# Altium schematic sheet EDU_High-Speed-Design_CPU_Control.SchDoc: CPU Control
size 431 x 279 mm; Date: not used; ApprovedBy: not used; CheckedBy: not used; Author: not used; DrawnBy: not used; Organization: not used; Address4: not used; SheetNumber: 25; SheetTotal: 26; Time: not used; ImagePath: not used; Application_BuildNumber: not used
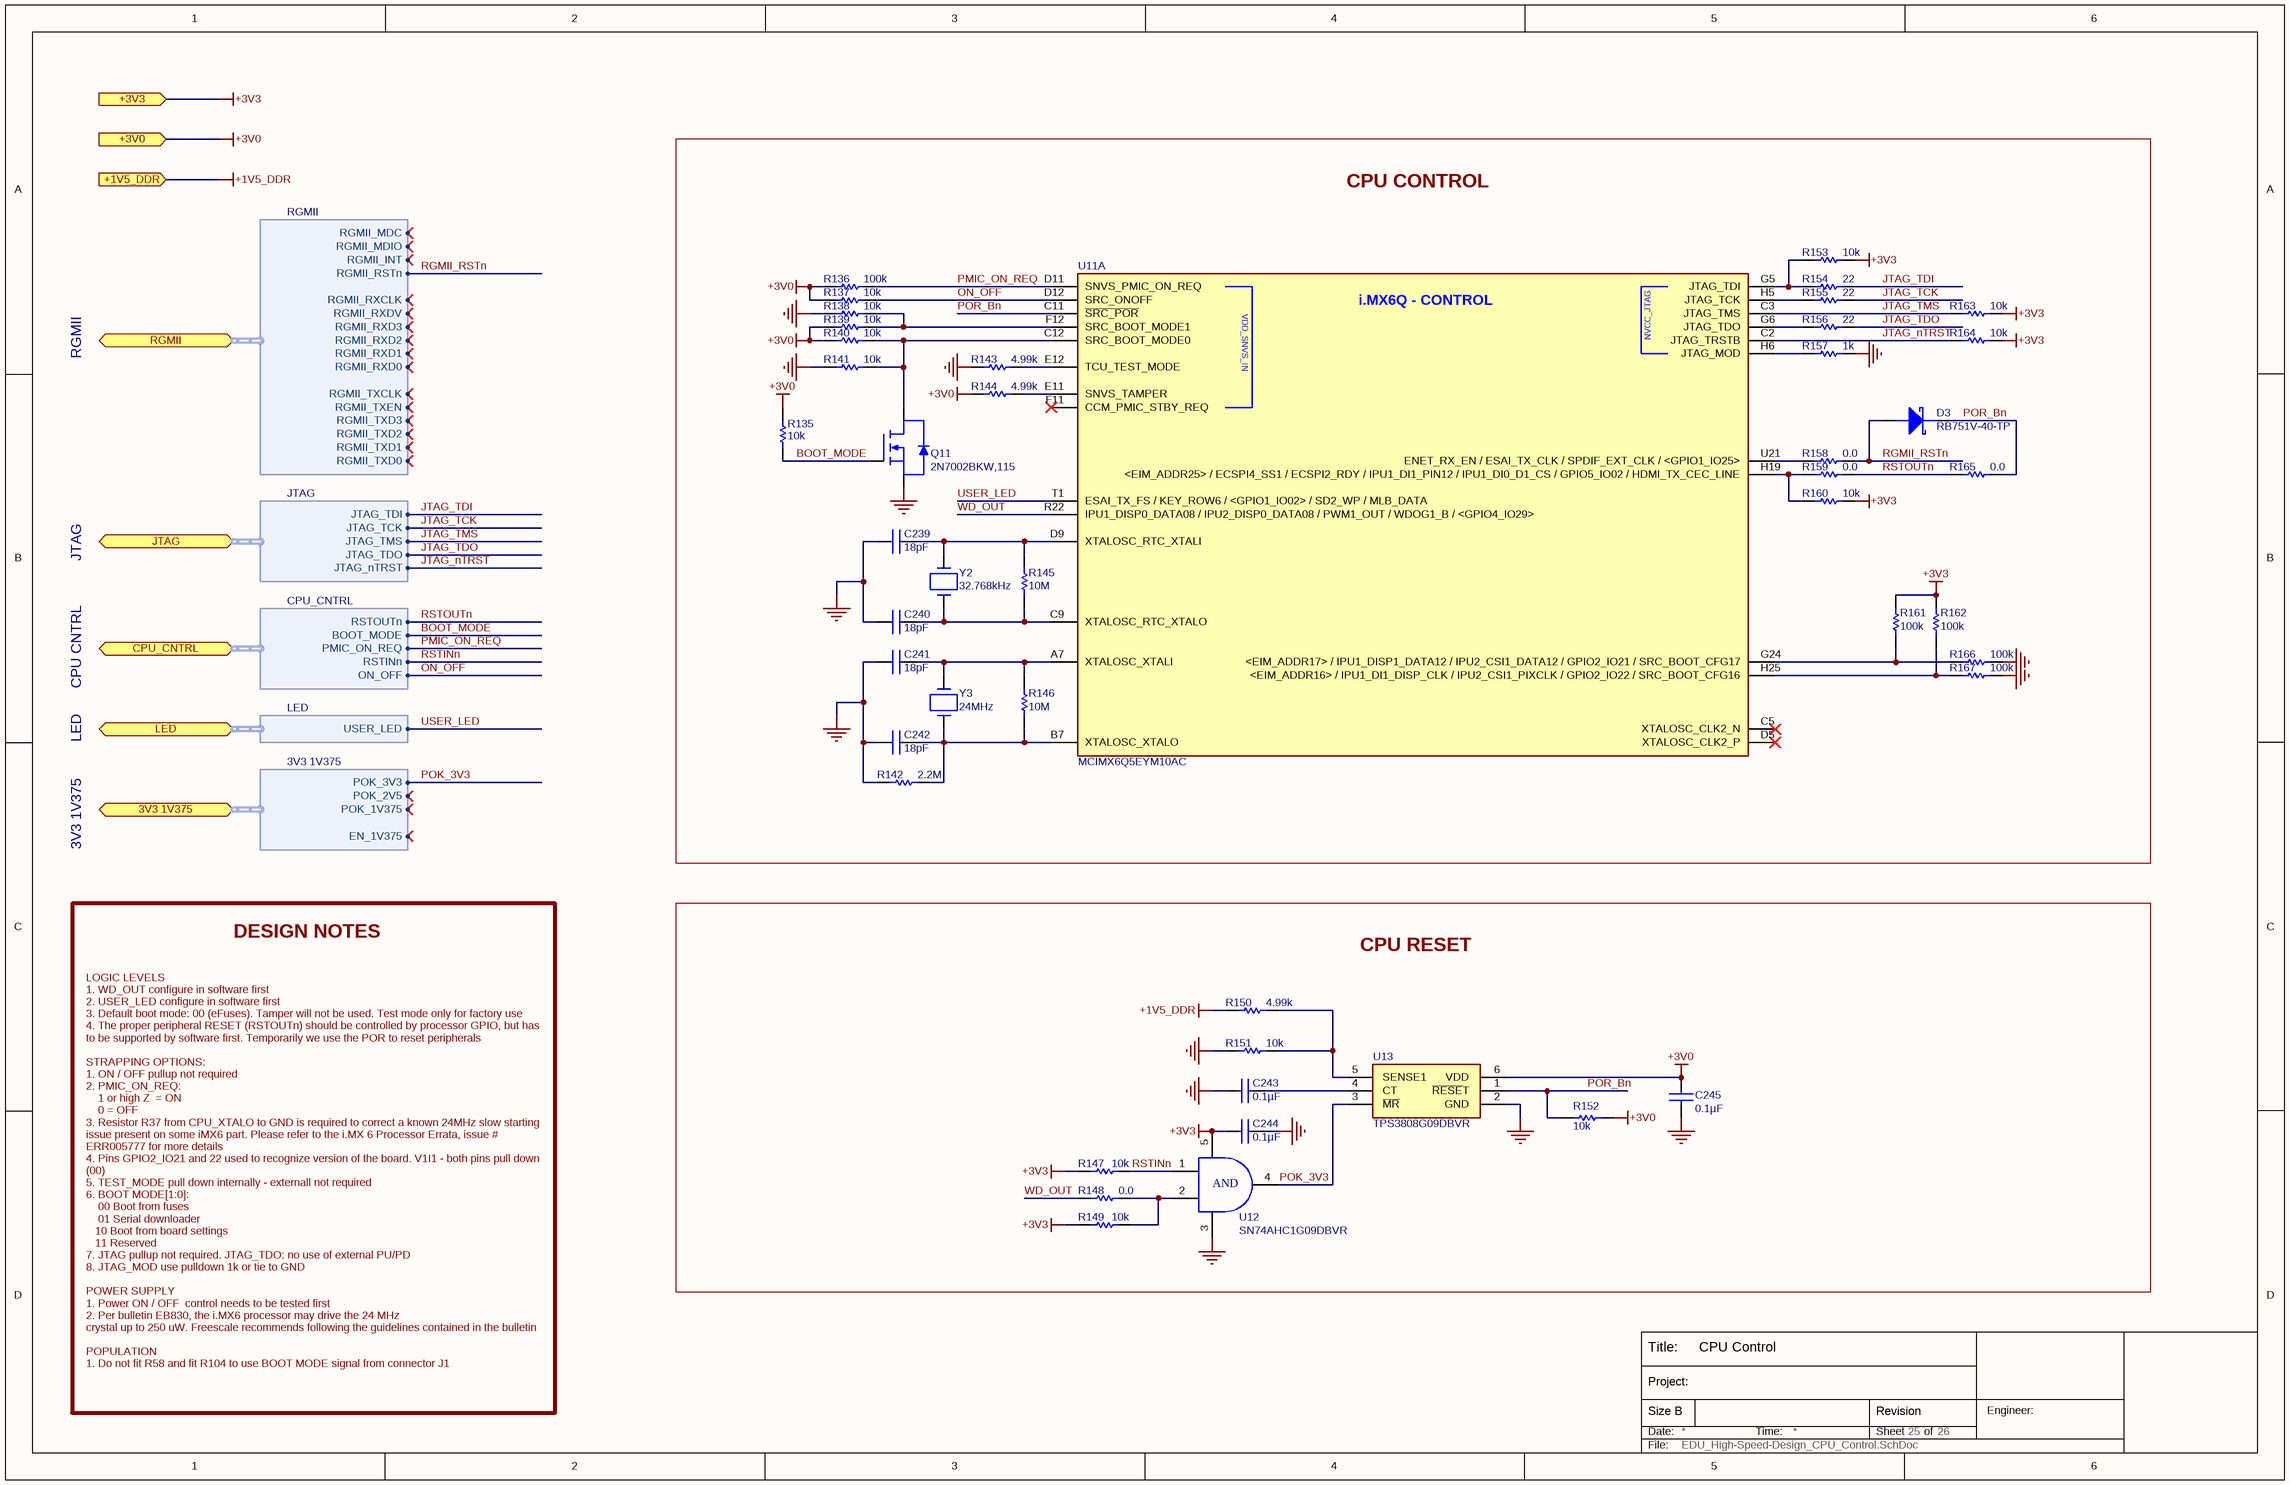
[diagram p0: EDU_High-Speed-Design_CPU_Control.SchDoc]

## Parts
C239  18pF  [C0402]
C240  18pF  [C0402]
C241  18pF  [C0402]
C242  18pF  [C0402]
C243  0.1µF  [C0402]
C244  0.1µF  [C0402]
C245  0.1µF  [C0402]
D3  RB751V-40-TP  [SOD-323]
Q11  2N7002BKW,115  [SOT-23-3]
R135  10k  [R0402]
R136  100k  [R0402]
R137  10k  [R0402]
R138  10k  [R0402]
R139  10k  [R0402]
R140  10k  [R0402]
R141  10k  [R0402]
R142  2.2M  [R0402]
R143  4.99k  [R0402]
R144  4.99k  [R0402]
R145  10M  [R0402]
R146  10M  [R0402]
R147  10k  [R0402]
R148  0.0  [R0402]
R149  10k  [R0402]
R150  4.99k  [R0402]
R151  10k  [R0402]
R152  10k  [R0402]
R153  10k  [R0402]
R154  22  [R0402]
R155  22  [R0402]
R156  22  [R0402]
R157  1k  [R0402]
R158  0.0  [R0402]
R159  0.0  [R0402]
R160  10k  [R0402]
R161  100k  [R0402]
R162  100k  [R0402]
R163  10k  [R0402]
R164  10k  [R0402]
R165  0.0  [R0402]
R166  100k  [R0402]
R167  100k  [R0402]
U11  MCIMX6Q5EYM10AC  [MCIMX6Q5EYM10AC]  (part A of 15)
U12  SN74AHC1G09DBVR  [SOT-23-5]
U13  TPS3808G09DBVR  [SOT-23-6]
Y2  32.768kHz  [ABS06]
Y3  24MHz  [ABM7]

## Blocks framed on the sheet
CPU CONTROL: C239-C242 D3 Q11 R135-R146 R153-R167 U11 Y2 Y3
CPU RESET: C243-C245 R147-R152 U12 U13

## Ports
3V3 1V375 (bidir, harness 3V3 1V375), +1V5_DDR (in), +3V0 (in), +3V3 (in), CPU_CNTRL (bidir, harness CPU_CNTRL), JTAG (bidir, harness JTAG), LED (bidir, harness LED), RGMII (bidir, harness RGMII)

## Harnesses
RGMII: RGMII_TXCLK, RGMII_TXEN, RGMII_TXD2, RGMII_TXD0, RGMII_TXD1, RGMII_TXD3, RGMII_RXDV, RGMII_RXCLK, RGMII_RXD3, RGMII_RXD2, RGMII_RXD1, RGMII_RXD0, RGMII_RSTn, RGMII_INT, RGMII_MDIO, RGMII_MDC
JTAG: JTAG_TDI, JTAG_TCK, JTAG_TMS, JTAG_nTRST, JTAG_TDO
CPU_CNTRL: RSTOUTn, PMIC_ON_REQ, ON_OFF, BOOT_MODE, RSTINn
LED: USER_LED
3V3 1V375: POK_3V3, POK_1V375, POK_2V5, EN_1V375

## Nets
+1V5_DDR: R150.2 ; port +1V5_DDR
+3V0: C245.1 R135.2 R136.2 R137.1 R139.1 R140.1 R144.2 R152.1 U13.6(VDD) ; port +3V0
+3V3: C244.1 R147.2 R149.2 R153.2 R160.2 R161.1 R162.1 R163.2 R164.2 U12.5(VCC) ; port +3V3
GND: C239.1 C240.1 C241.1 C242.1 C243.1 C244.2 C245.2 Q11.2(S) R138.1 R141.1 R142.2 R143.2 R151.2 R157.1 R166.2 R167.2 U12.3(GND) U13.2(GND)
BOOT_MODE: Q11.1(G) R135.1 ; port CPU_CNTRL.BOOT_MODE
JTAG_nTRST: R164.1 U11.C2(JTAG_TRSTB) ; port JTAG.JTAG_nTRST
JTAG_TCK: R155.1 ; port JTAG.JTAG_TCK
JTAG_TDI: R154.1 ; port JTAG.JTAG_TDI
JTAG_TDO: R156.1 ; port JTAG.JTAG_TDO
JTAG_TMS: R163.1 U11.C3(JTAG_TMS) ; port JTAG.JTAG_TMS
ON_OFF: R137.2 U11.D12(SRC_ONOFF) ; port CPU_CNTRL.ON_OFF
PMIC_ON_REQ: R136.1 U11.D11(SNVS_PMIC_ON_REQ) ; port CPU_CNTRL.PMIC_ON_REQ
POK_3V3: U12.4(Y) U13.3(~{MR}) ; port 3V3 1V375.POK_3V3
POR_Bn: D3.1(cathode) R152.2 R165.2 U11.C11(~{SRC_POR}) U13.1(~{RESE}T)
RGMII_RSTn: D3.2(ANODE) R158.2 ; port RGMII.RGMII_RSTn
RSTINn: R147.1 U12.1(A) ; port CPU_CNTRL.RSTINn
RSTOUTn: R159.2 R165.1 ; port CPU_CNTRL.RSTOUTn
USER_LED: U11.T1(ESAI_TX_FS_/_KEY_ROW6_/_<GPIO1_IO02>_/_SD2_WP_/_MLB_DATA) ; port LED.USER_LED
WD_OUT: R148.1 U11.R22(IPU1_DISP0_DATA08_/_IPU2_DISP0_DATA08_/_PWM1_OUT_/_WDOG1_B_/_<GPIO4_IO29>)
NetC239_2: C239.2 R145.1 U11.D9(XTALOSC_RTC_XTALI) Y2.2
NetC240_2: C240.2 R145.2 U11.C9(XTALOSC_RTC_XTALO) Y2.1
NetC241_2: C241.2 R146.1 U11.A7(XTALOSC_XTALI) Y3.2
NetC242_2: C242.2 R142.1 R146.2 U11.B7(XTALOSC_XTALO) Y3.1
NetC243_2: C243.2 U13.4(CT)
NetQ11_3: Q11.3(D) R140.2 R141.2 U11.C12(SRC_BOOT_MODE0)
NetR138_2: R138.2 R139.2 U11.F12(SRC_BOOT_MODE1)
NetR143_1: R143.1 U11.E12(TCU_TEST_MODE)
NetR144_1: R144.1 U11.E11(SNVS_TAMPER)
NetR148_2: R148.2 R149.1 U12.2(B)
NetR150_1: R150.1 R151.1 U13.5(SENSE1)
NetR153_1: R153.1 R154.2 U11.G5(JTAG_TDI)
NetR155_2: R155.2 U11.H5(JTAG_TCK)
NetR156_2: R156.2 U11.G6(JTAG_TDO)
NetR157_2: R157.2 U11.H6(JTAG_MOD)
NetR158_1: R158.1 U11.U21(ENET_RX_EN_/_ESAI_TX_CLK_/_SPDIF_EXT_CLK_/_<GPIO1_IO25>)
NetR159_1: R159.1 R160.1 U11.H19(<EIM_ADDR25>_/_ECSPI4_SS1_/_ECSPI2_RDY_/_IPU1_DI1_PIN12_/_IPU1_DI0_D1_CS_/_GPIO5_IO02_/_HDMI_TX_CEC_LINE)
NetR161_2: R161.2 R166.1 U11.G24(<EIM_ADDR17>_/_IPU1_DISP1_DATA12_/_IPU2_CSI1_DATA12_/_GPIO2_IO21_/_SRC_BOOT_CFG17)
NetR162_2: R162.2 R167.1 U11.H25(<EIM_ADDR16>_/_IPU1_DI1_DISP_CLK_/_IPU2_CSI1_PIXCLK_/_GPIO2_IO22_/_SRC_BOOT_CFG16)

Not connected (* = marked no-connect by the designer): U11 C5(XTALOSC_CLK2_N)* D5(XTALOSC_CLK2_P)* F11(CCM_PMIC_STBY_REQ)*

## Notes on the sheet
- RGMII
- JTAG
- CPU CNTRL
- LED
- 3V3 1V375
- DESIGN NOTES
- LOGIC LEVELS
  1. WD_OUT configure in software first
  2. USER_LED configure in software first
  3. Default boot mode: 00 (eFuses). Tamper will not be used. Test mode only for factory use
  4. The proper peripheral RESET (RSTOUTn) should be controlled by processor GPIO, but has to be supported by software first. Temporarily we use the POR to reset peripherals
  STRAPPING OPTIONS:
  1. ON / OFF pullup not required
  2. PMIC_ON_REQ:
  1 or high Z  = ON
  0 = OFF
  3. Resistor R37 from CPU_XTALO to GND is required to correct a known 24MHz slow starting issue present on some iMX6 part. Please refer to the i.MX 6 Processor Errata, issue # ERR005777 for more details
  4. Pins GPIO2_IO21 and 22 used to recognize version of the board. V1I1 - both pins pull down (00)
  5. TEST_MODE pull down internally - externall not required
  6. BOOT MODE[1:0]:
  00 Boot from fuses
  01 Serial downloader
  10 Boot from board settings
  11 Reserved
  7. JTAG pullup not required. JTAG_TDO: no use of external PU/PD
  8. JTAG_MOD use pulldown 1k or tie to GND
  POWER SUPPLY
  1. Power ON / OFF  control needs to be tested first
  2. Per bulletin EB830, the i.MX6 processor may drive the 24 MHz
  crystal up to 250 uW. Freescale recommends following the guidelines contained in the bulletin
  POPULATION
  1. Do not fit R58 and fit R104 to use BOOT MODE signal from connector J1
- Title:
- Date:
- Size B
- Project:
- Time:
- Sheet
- Revision
- of
- Engineer:
- File:
- (in symbol MCIMX6Q5EYM10AC, part A) i.MX6Q - CONTROL
- (in symbol SN74AHC1G09DBVR) AND

## Library data of the parts
C239-C242 = C1005C0G1H180J: CAP CER 18PF 50V C0G 5% 0402; Manufacturer 1: TDK Corporation; Capacitance: 18pF; Manufacturer Part Number 1: C1005C0G1H180J; Supplier 1: Digi-Key; Supplier Part Number 1: 445-1238-1-ND; ComponentLink1URL: http://www.tdk.co.jp/tefe02/e412_c.pdf; ComponentLink1Description: http://www.tdk.co.jp/tefe02/e412_c.pdf; Voltage: 50V
C243-C245 = C1005X5R1H104K: CAP CER .10UF 50V X5R 10% 0402; Manufacturer 1: TDK Corporation; Capacitance: 0.1µF; Manufacturer Part Number 1: C1005X5R1H104K; Voltage: 50V; Supplier 1: Digi-Key; Supplier Part Number 1: 445-5942-1-ND; ComponentLink1URL: http://www.tdk.co.jp/tefe02/e412_c.pdf; ComponentLink1Description: http://www.tdk.co.jp/tefe02/e412_c.pdf
D3 = RB751V-40-TP: DIODE SCHTKY 30MA 30V SOD-323; Manufacturer 1: Micro Commercial Co; Supplier 1: Digi-Key; Supplier Part Number 1: RB751V-40-TPMSCT-ND; Manufacturer Part Number 1: RB751V-40-TP
Q11 = 2N7002BKW,115: MOSFET N-CH 60V 310MA SOT323; Manufacturer 1: NXP Semiconductors; Supplier 1: Digi-Key; Supplier Part Number 1: 568-5980-1-ND; Manufacturer Part Number 1: 2N7002BKW,115; ComponentLink1URL: http://www.nxp.com/documents/data_sheet/2N7002BKW.pdf; ComponentLink1Description: http://www.nxp.com/documents/data_sheet/2N7002BKW.pdf
R135 R137-R141 R147 R149 R151-R153 R160 R163 R164 = RC0402FR-0710KL: RES 10.0K OHM 1/16W 1% 0402 SMD; Manufacturer 1: Yageo; Manufacturer Part Number 1: RC0402FR-0710KL; Resistance: 10k; Supplier 1: Digi-Key; Supplier Part Number 1: 311-10.0KLRCT-ND; ComponentLink1URL: http://www.yageo.com/documents/recent/PYu-RC0402_51_RoHS_L_6.pdf; ComponentLink1Description: http://www.yageo.com/documents/recent/PYu-RC0402_51_RoHS_L_6.pdf
R136 R161 R162 R166 R167 = RMCF0402FT100K: RES 100K OHM 1/16W 1% 0402 SMD; Manufacturer 1: Stackpole Electronics Inc; Manufacturer Part Number 1: RMCF0402FT100K; Resistance: 100k; Supplier 1: Digi-Key; Supplier Part Number 1: RMCF0402FT100KCT-ND; ComponentLink1URL: http://www.seielect.com/Catalog/SEI-RMCF.pdf; ComponentLink1Description: http://www.seielect.com/Catalog/SEI-RMCF.pdf
R142 = CRCW04022M20FKED: RES 2.20M OHM 1/16W 1% 0402 SMD; Manufacturer 1: Vishay Dale; Supplier 1: Digi-Key; Manufacturer Part Number 1: CRCW04022M20FKED; Resistance: 2.2M; ComponentLink1URL: http://www.vishay.com/doc?20035; ComponentLink1Description: http://www.vishay.com/doc?20035; Supplier Part Number 1: 541-2.20MLCT-ND
R143 R144 R150 = RMCF0402FT4K99: RES TF 4.99K OHM 1% 1/16W 0402; Manufacturer 1: Stackpole Electronics Inc; Manufacturer Part Number 1: RMCF0402FT4K99; Resistance: 4.99k; Supplier 1: Digi-Key; Supplier Part Number 1: RMCF0402FT4K99CT-ND; ComponentLink1URL: http://www.seielect.com/Catalog/SEI-RMCF.pdf; ComponentLink1Description: http://www.seielect.com/Catalog/SEI-RMCF.pdf
R145 R146 = CRCW040210M0FKED: RES 10.0M OHM 1/16W 1% 0402 SMD; Manufacturer 1: Vishay Dale; Supplier 1: Digi-Key; Supplier Part Number 1: 541-10.0MLCT-ND; Manufacturer Part Number 1: CRCW040210M0FKED; Resistance: 10M; ComponentLink1URL: http://www.vishay.com/doc?20035; ComponentLink1Description: http://www.vishay.com/doc?20035
R148 R158 R159 R165 = RC0402JR-070RL: RES 0.0 OHM 1/16W 0402 SMD; Manufacturer 1: Yageo; Manufacturer Part Number 1: RC0402JR-070RL; Resistance: 0.0; Supplier 1: Digi-Key; Supplier Part Number 1: 311-0.0JRCT-ND; ComponentLink1URL: http://www.yageo.com/documents/recent/PYu-RC0402_51_RoHS_L_6.pdf; ComponentLink1Description: http://www.yageo.com/documents/recent/PYu-RC0402_51_RoHS_L_6.pdf
R154-R156 = RC0402FR-0722RL: RES 22.0 OHM 1/16W 1% 0402 SMD; Manufacturer 1: Yageo; Manufacturer Part Number 1: RC0402FR-0722RL; Resistance: 22; Supplier 1: Digi-Key; Supplier Part Number 1: 311-22.0LRCT-ND; ComponentLink1URL: http://www.yageo.com/documents/recent/PYu-RC0402_51_RoHS_L_6.pdf; ComponentLink1Description: http://www.yageo.com/documents/recent/PYu-RC0402_51_RoHS_L_6.pdf
R157 = RC0402FR-071KL: RES 1.00K OHM 1/16W 1% 0402 SMD; Manufacturer 1: Yageo; Manufacturer Part Number 1: RC0402FR-071KL; Resistance: 1k; Supplier 1: Digi-Key; Supplier Part Number 1: 311-1.00KLRCT-ND; ComponentLink1URL: http://www.yageo.com/documents/recent/PYu-RC0402_51_RoHS_L_6.pdf; ComponentLink1Description: http://www.yageo.com/documents/recent/PYu-RC0402_51_RoHS_L_6.pdf
U11 = MCIMX6Q5EYM10AC: IC MCU 32BIT ARM QUAD 624FCBGA; Manufacturer 1: Freescale Semiconductor; Supplier 1: Digi-Key; Manufacturer Part Number 1: MCIMX6Q5EYM10AC; Supplier Part Number 1: MCIMX6Q5EYM10AC-ND
U12 = SN74AHC1G09DBVR: IC GATE AND SGL 2INP SOT23-5; Manufacturer: Texas Instruments; Logic Type: AND Gate; Number of Circuits: 1; Number of Inputs: 2; Voltage - Supply: 2 V ~ 5.5 V; Current - Quiescent (Max): 1µA; Current - Output High, Low: -, 8mA; Logic Level - Low: 0.5 V ~ 1.65 V; Logic Level - High: 1.5 V ~ 3.85 V; Max Propagation Delay @ V, Max CL: 7.5ns @ 5V, 50pF; .Creator: MM; .Checked PCB: RF, used by MM; .Checked SCH: MM, checked by RF; Supplier 1: Digi-Key; Manufacturer Part Number: SN74AHC1G09DBVR; RoHS: RoHS Compliant; Category: Integrated Circuits (ICs); Stock 1: 3468; Pricing 1: 1=0.49, 10=0.345, 25=0.2836, 100=0.2265, 250=0.165, 500=0.134, 1000=0.103 (USD); Features: Open Drain; Operating Temperature: -55°C ~ 125°C; Mounting Type: Surface Mount; Supplier Device Package: SOT-23-5; Package / Case: SC-74A, SOT-753; Packaging: Cut Tape (CT); ComponentLink1URL: http://www.ti.com/lit/ds/symlink/sn74ahc1g09.pdf; ComponentLink1Description: http://www.ti.com/lit/ds/symlink/sn74ahc1g09.pdf; Supplier Part Number 1: 296-29202-1-ND
U13 = TPS3808G09DBVR: IC VOLT SUPERVISOR 0.9V SOT23-6; Manufacturer 1: Texas Instruments; Manufacturer Part Number 1: TPS3808G09DBVR; Supplier 1: Digi-Key; Supplier Part Number 1: 296-17189-1-ND; ComponentLink1URL: http://www.ti.com/lit/ds/symlink/tps3808g01.pdf; ComponentLink1Description: http://www.ti.com/lit/ds/symlink/tps3808g01.pdf
Y2 = ABS06-32.768KHZ-9-1-T: CRYSTAL 32.768 KHZ 9.0 PF SMD; Manufacturer 1: Abracon Corporation; Manufacturer Part Number 1: ABS06-32.768KHZ-9-1-T; Frequency: 32.768kHz; Supplier 1: Digi-Key; ComponentLink1URL: http://www.abracon.com/Resonators/ABS06.pdf; ComponentLink1Description: http://www.abracon.com/Resonators/ABS06.pdf; Supplier Part Number 1: 535-10247-1-ND
Y3 = ABM7-24.000MHZ-D-2-Y-T: CRYSTAL 24.0000MHZ 18PF SMD; Manufacturer 1: Abracon Corporation; Supplier 1: Digi-Key; Manufacturer Part Number 1: ABM7-24.000MHZ-D-2-Y-T; Frequency: 24MHz; ComponentLink1URL: http://www.abracon.com/Resonators/abm7.pdf; ComponentLink1Description: http://www.abracon.com/Resonators/abm7.pdf; Supplier Part Number 1: 535-9845-1-ND